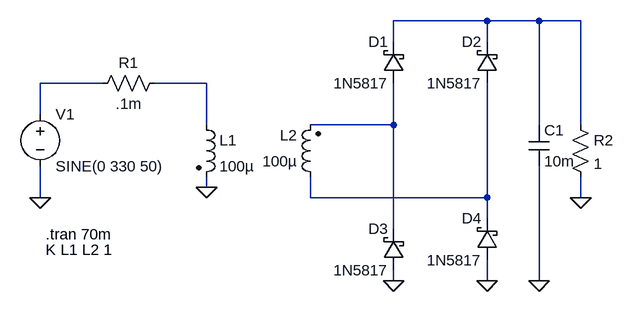
[diagram p0: schematic twoPulseRect.asc]
twoPulseRect.asc, the LTspice schematic file:
Version 4
SHEET 1 880 680
WIRE 672 -32 528 -32
WIRE 752 -32 672 -32
WIRE 816 -32 752 -32
WIRE 528 0 528 -32
WIRE 672 0 672 -32
WIRE 80 64 -16 64
WIRE 240 64 160 64
WIRE -16 112 -16 64
WIRE 240 128 240 64
WIRE 528 128 528 64
WIRE 528 128 400 128
WIRE 752 128 752 -32
WIRE 816 128 816 -32
WIRE 240 224 240 208
WIRE -16 240 -16 192
WIRE 400 240 400 208
WIRE 672 240 672 64
WIRE 672 240 400 240
WIRE 816 240 816 208
WIRE 672 272 672 240
WIRE 528 288 528 128
WIRE 528 368 528 352
WIRE 672 368 672 336
WIRE 752 368 752 192
FLAG -16 240 0
FLAG 240 224 0
FLAG 816 240 0
FLAG 528 368 0
FLAG 672 368 0
FLAG 752 368 0
SYMBOL voltage -16 96 R0
WINDOW 123 0 0 Left 0
WINDOW 39 0 0 Left 0
SYMATTR InstName V1
SYMATTR Value SINE(0 330 50)
SYMBOL res 176 48 R90
WINDOW 0 0 56 VBottom 2
WINDOW 3 32 56 VTop 2
SYMATTR InstName R1
SYMATTR Value .1m
SYMBOL ind2 224 112 R0
SYMATTR InstName L1
SYMATTR Value 100µ
SYMATTR Type ind
SYMBOL ind2 416 224 R180
WINDOW 0 36 80 Left 2
WINDOW 3 36 40 Left 2
SYMATTR InstName L2
SYMATTR Value 100µ
SYMATTR Type ind
SYMBOL res 800 112 R0
SYMATTR InstName R2
SYMATTR Value 1
SYMBOL cap 736 128 R0
SYMATTR InstName C1
SYMATTR Value 10m
SYMBOL schottky 544 64 R180
WINDOW 0 24 64 Left 2
WINDOW 3 24 0 Left 2
SYMATTR InstName D1
SYMATTR Value 1N5817
SYMATTR Description Diode
SYMATTR Type diode
SYMBOL schottky 688 64 R180
WINDOW 0 24 64 Left 2
WINDOW 3 24 0 Left 2
SYMATTR InstName D2
SYMATTR Value 1N5817
SYMATTR Description Diode
SYMATTR Type diode
SYMBOL schottky 544 352 R180
WINDOW 0 24 64 Left 2
WINDOW 3 24 0 Left 2
SYMATTR InstName D3
SYMATTR Value 1N5817
SYMATTR Description Diode
SYMATTR Type diode
SYMBOL schottky 688 336 R180
WINDOW 0 24 64 Left 2
WINDOW 3 24 0 Left 2
SYMATTR InstName D4
SYMATTR Value 1N5817
SYMATTR Description Diode
SYMATTR Type diode
TEXT -8 320 Left 2 !K L1 L2 1
TEXT -8 296 Left 2 !.tran 70m

The netlist it stands for:
* twoPulseRect.asc
V1 N002 0 SINE(0 330 50)
R1 N003 N002 .1m
L1 N003 0 100µ
L2 N005 N004 100µ
R2 N001 0 1
C1 N001 0 10m
D1 N004 N001 1N5817
D2 N005 N001 1N5817
D3 0 N004 1N5817
D4 0 N005 1N5817
.model D D
.lib standard.dio
K L1 L2 1
.tran 70m
.backanno
.end